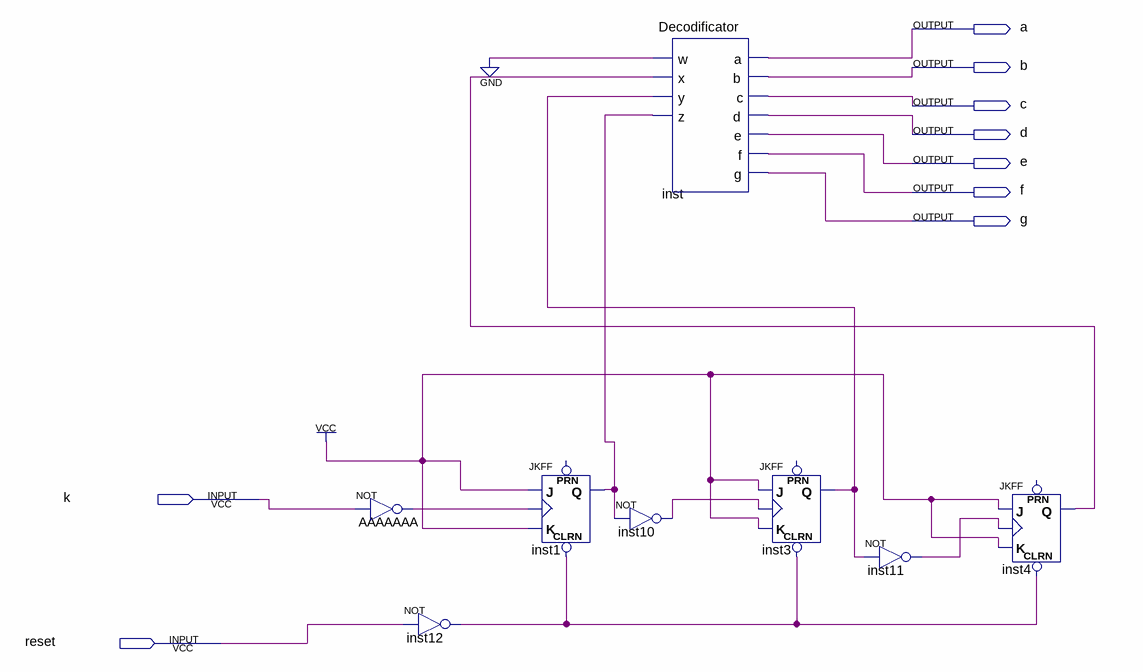
[diagram p0: schematic sheet]
// Quartus schematic contadorassinc.bdf as structural Verilog: 8 symbols, 9 pins
module contadorassinc (
  input  k,
  input  reset,
  output a,
  output b,
  output c,
  output d,
  output e,
  output f,
  output g
);

  wire AAAAAAA_out, inst1_q, inst3_q, inst4_q, inst10_out, inst11_out, inst12_out;

  not AAAAAAA (AAAAAAA_out, k);
  not inst12 (inst12_out, reset);
  JKFF inst1 (.CLRN(inst12_out), .K(1'b1), .J(1'b1), .CLK(AAAAAAA_out), .Q(inst1_q));  // open: PRN
  Decodificator inst (.w(1'b0), .x(inst4_q), .y(inst3_q), .z(inst1_q), .a(a), .b(b), .c(c), .d(d), .e(e), .f(f), .g(g));
  not inst10 (inst10_out, inst1_q);
  JKFF inst3 (.CLRN(inst12_out), .K(1'b1), .J(1'b1), .CLK(inst10_out), .Q(inst3_q));  // open: PRN
  not inst11 (inst11_out, inst3_q);
  JKFF inst4 (.CLRN(inst12_out), .K(1'b1), .J(1'b1), .CLK(inst11_out), .Q(inst4_q));  // open: PRN
endmodule
